# EAGLE design h-bridge-mk1 (EAGLE 6.3)
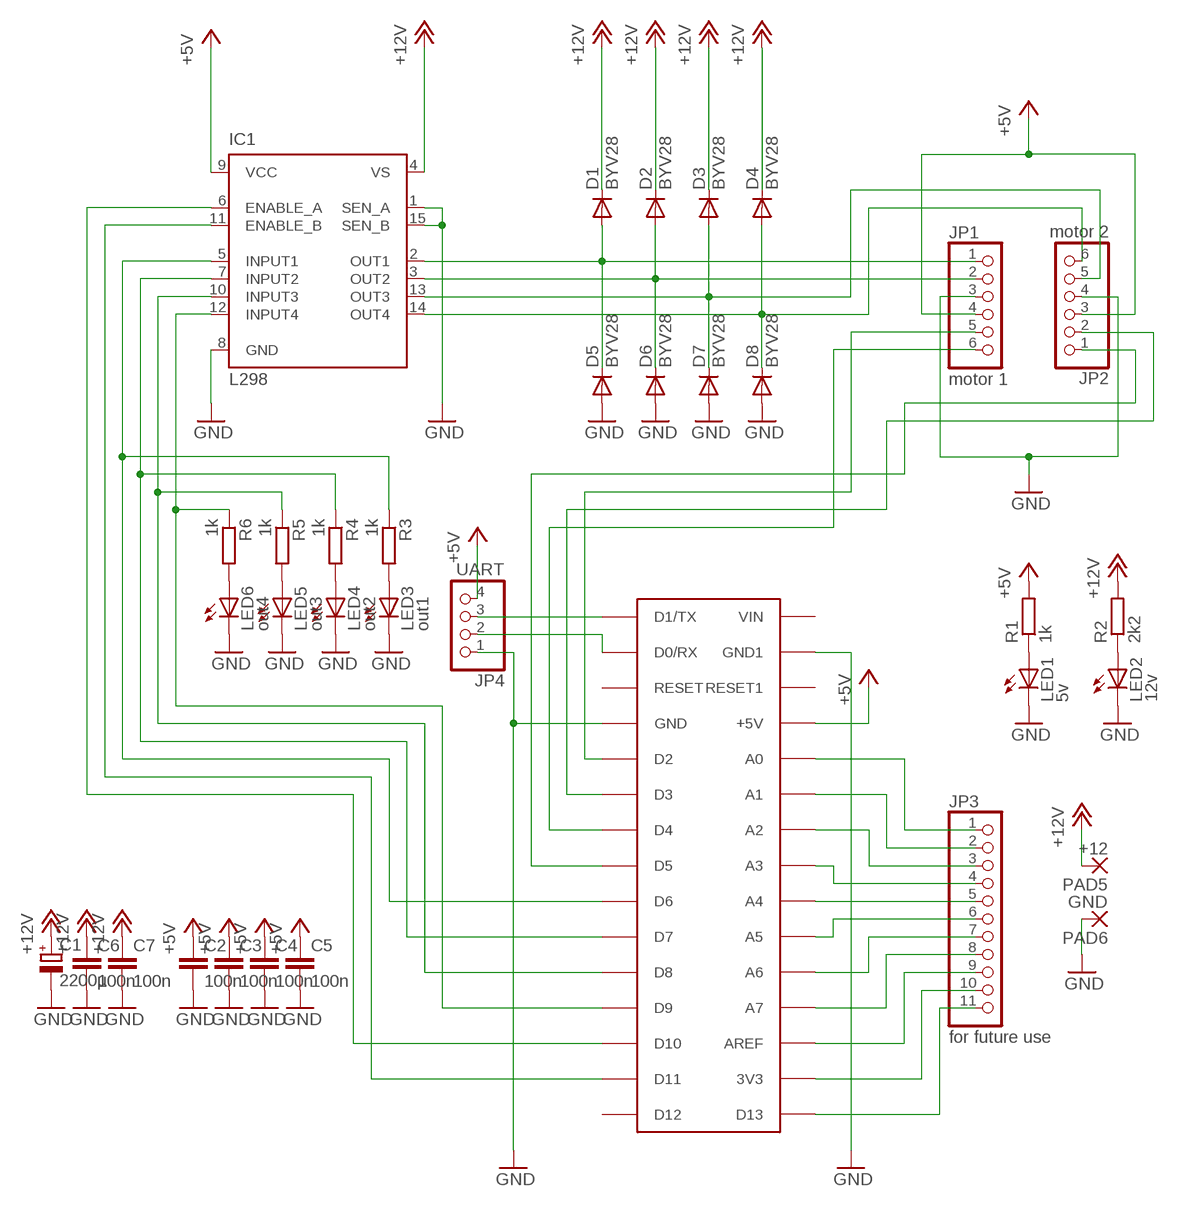
[diagram p0: schematic, sheet 1]

## Parts
C1  2200µ  CPOL-EUE5-10.5  [E5-10,5]
C2  100n  C-EU025-025X050  [C025-025X050]
C3  100n  C-EU025-025X050  [C025-025X050]
C4  100n  C-EU025-025X050  [C025-025X050]
C5  100n  C-EU025-025X050  [C025-025X050]
C6  100n  C-EU025-025X050  [C025-025X050]
C7  100n  C-EU025-025X050  [C025-025X050]
D1  BYV28  [SOD64-10]
D2  BYV28  [SOD64-10]
D3  BYV28  [SOD64-10]
D4  BYV28  [SOD64-10]
D5  BYV28  [SOD64-10]
D6  BYV28  [SOD64-10]
D7  BYV28  [SOD64-10]
D8  BYV28  [SOD64-10]
IC1  L298  [MULTIWATT-15]
JP1  motor 1  PINHD-1X6  [1X06]
JP2  motor 2  PINHD-1X6  [1X06]
JP3  for future use  PINHD-1X11  [1X11]
JP4  UART  PINHD-1X4  [1X04]
LED1  5v  LED3MM  [LED3MM]
LED2  12v  LED3MM  [LED3MM]
LED3  out1  LED3MM  [LED3MM]
LED4  out2  LED3MM  [LED3MM]
LED5  out3  LED3MM  [LED3MM]
LED6  out4  LED3MM  [LED3MM]
PAD5  +12  3,81/1,1  [3,81/1,1]
PAD6  GND  3,81/1,1  [3,81/1,1]
R1  1k  R-EU_0207/10  [0207/10]
R2  2k2  R-EU_0207/10  [0207/10]
R3  1k  R-EU_0207/10  [0207/10]
R4  1k  R-EU_0207/10  [0207/10]
R5  1k  R-EU_0207/10  [0207/10]
R6  1k  R-EU_0207/10  [0207/10]
U$1  ARDUINONANO  [PDIP-32]

## Nets
+5V: C2.1 C3.1 C4.1 C5.1 IC1.9(VCC) JP1.4 JP2.3 JP4.4 R1.2 U$1.+5V
+12V: C1.+ C6.1 C7.1 D1.C D2.C D3.C D4.C IC1.4(VS) PAD5.1(P) R2.2
ENA: IC1.6(ENABLE_A) U$1.D10
ENB: IC1.11(ENABLE_B) U$1.D11
GND: C1.- C2.2 C3.2 C4.2 C5.2 C6.2 C7.2 D5.A D6.A D7.A D8.A IC1.1(SEN_A) IC1.8(GND) IC1.15(SEN_B) JP1.3 JP2.4 JP4.1 LED1.K(C) LED2.K(C) LED3.K(C) LED4.K(C) LED5.K(C) LED6.K(C) PAD6.1(P) U$1.GND U$1.GND1
INA1: IC1.5(INPUT1) R3.1 U$1.D6
INA2: IC1.7(INPUT2) R4.1 U$1.D7
INB1: IC1.10(INPUT3) R5.1 U$1.D8
INB2: IC1.12(INPUT4) R6.1 U$1.D9
N$1: JP3.1 U$1.A0
N$2: JP3.2 U$1.A1
N$3: JP3.3 U$1.A2
N$4: JP3.4 U$1.A3
N$5: JP2.2 U$1.D3
N$6: JP1.6 U$1.D4
N$7: JP2.1 U$1.D5
N$8: JP3.5 U$1.A4
N$9: JP1.5 U$1.D2
N$10: JP3.6 U$1.A5
N$11: JP3.7 U$1.A6
N$12: JP3.8 U$1.A7
N$13: JP3.9 U$1.AREF
N$14: JP3.10 U$1.3V3
N$15: JP3.11 U$1.D13
N$16: LED1.A R1.1
N$17: LED2.A R2.1
N$18: LED3.A R3.2
N$19: LED4.A R4.2
N$20: LED5.A R5.2
N$21: LED6.A R6.2
N$25: JP4.3 U$1.D1/TX
N$26: JP4.2 U$1.D0/RX
OUT1: D1.A D5.C IC1.2(OUT1) JP1.1
OUT2: D2.A D6.C IC1.3(OUT2) JP1.2
OUT3: D3.A D7.C IC1.13(OUT3) JP2.5
OUT4: D4.A D8.C IC1.14(OUT4) JP2.6
Unconnected: U$1.D12 U$1.RESET U$1.RESET1 U$1.VIN

## Library data of the parts
C1 = rcl:CPOL-EU: POLARIZED CAPACITOR, European symbol
C2-C7 = rcl:C-EU: CAPACITOR, European symbol
D1-D8 = diode:BYV28: DIODE ultra fast
IC1 = st-microelectronics:L298: DUAL FULL-BRIDGE DRIVER; MPN: L298N; OC_FARNELL: 1589425; OC_NEWARK: 32M1527
JP1 JP2 = pinhead:PINHD-1X6: PIN HEADER
JP3 = pinhead:PINHD-1X11: PIN HEADER
JP4 = pinhead:PINHD-1X4: PIN HEADER
LED1-LED6 = led:LED: LED OSRAM: - CHIPLED LG R971, LG N971, LY N971, LG Q971, LY Q971, LO R971, LY R971 LH N974, LH R974 LS Q976, LO Q976, LY Q976 LO Q996 - Hyper CHIPLED LW Q18S LB Q993, LB Q99A, LB R99A - SideLED LS A670, LO A670, LY A670, LG A670, LP A670 LB A673, LV A673, LT A673, LW A673 LH A674 LY A675 LS A676, LA A676, LO A676, LY A676, LW A676 LS A679, LY A679, LG A679 - Hyper Micro SIDELED® LS Y876, LA Y876, LO Y876, LY Y876 LT Y87S - SmartLED LW L88C, LW L88S LB L89C, LB L89S, LG L890 LS L89K, LO L89K, LY L89K LS L896, LA L896, LO L896, LY L896 - TOPLED LS T670, LO T670, LY T670, LG T670, LP T670 LSG T670, LSP T670, LSY T670, LOP T670, LYG T670 LG T671, LOG T671, LSG T671 LB T673, LV T673, LT T673, LW T673 LH T674 LS T676, LA T676, LO T676, LY T676, LB T676, LH T676, LSB T676, LW T676 LB T67C, LV T67C, LT T67C, LS T67K, LO T67K, LY T67K, LW E67C LS E67B, LA E67B, LO E67B, LY E67B, LB E67C, LV E67C, LT E67C LW T67C LS T679, LY T679, LG T679 LS T770, LO T770, LY T770, LG T770, LP T770 LB T773, LV T773, LT T773, LW T773 LH T774 LS E675, LA E675, LY E675, LS T675 LS T776, LA T776, LO T776, LY T776, LB T776 LHGB T686 LT T68C, LB T68C - Hyper Mini TOPLED® LB M676 - Mini TOPLED Santana® LG M470 LS M47K, LO M47K, LY M47K Source: http://www.osram.convergy.de LUXEON: - LUMILED® LXK2-PW12-R00, LXK2-PW12-S00, LXK2-PW14-U00, LXK2-PW14-V00 LXK2-PM12-R00, LXK2-PM12-S00, LXK2-PM14-U00 LXK2-PE12-Q00, LXK2-PE12-R00, LXK2-PE12-S00, LXK2-PE14-T00, LXK2-PE14-U00 LXK2-PB12-K00, LXK2-PB12-L00, LXK2-PB12-M00, LXK2-PB14-N00, LXK2-PB14-P00, LXK2-PB14-Q00 LXK2-PR12-L00, LXK2-PR12-M00, LXK2-PR14-Q00, LXK2-PR14-R00 LXK2-PD12-Q00, LXK2-PD12-R00, LXK2-PD12-S00 LXK2-PH12-R00, LXK2-PH12-S00 LXK2-PL12-P00, LXK2-PL12-Q00, LXK2-PL12-R00 Source: www.luxeon.com KINGBRIGHT: KA-3528ASYC Source: www.kingbright.com
PAD5 PAD6 = wirepad:3,81/1,1: THROUGH-HOLE PAD
R1-R6 = rcl:R-EU_: RESISTOR, European symbol
U$1 = jet-lib:ARDUINONANO

## Board
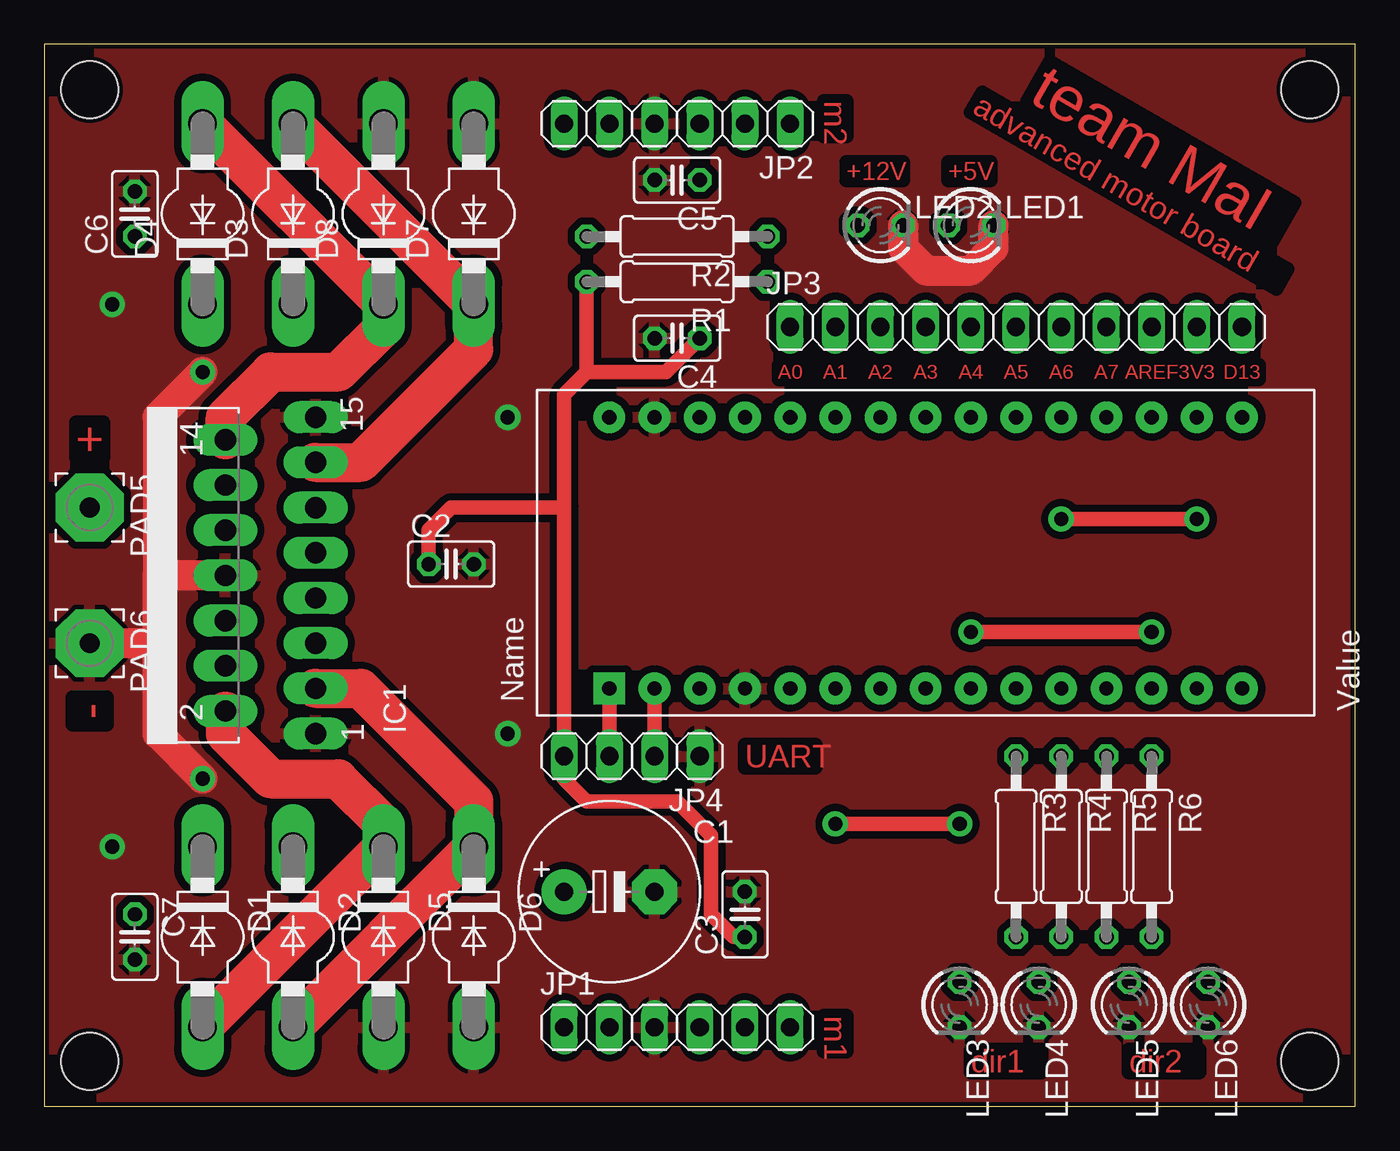
[diagram p1: board, top side]
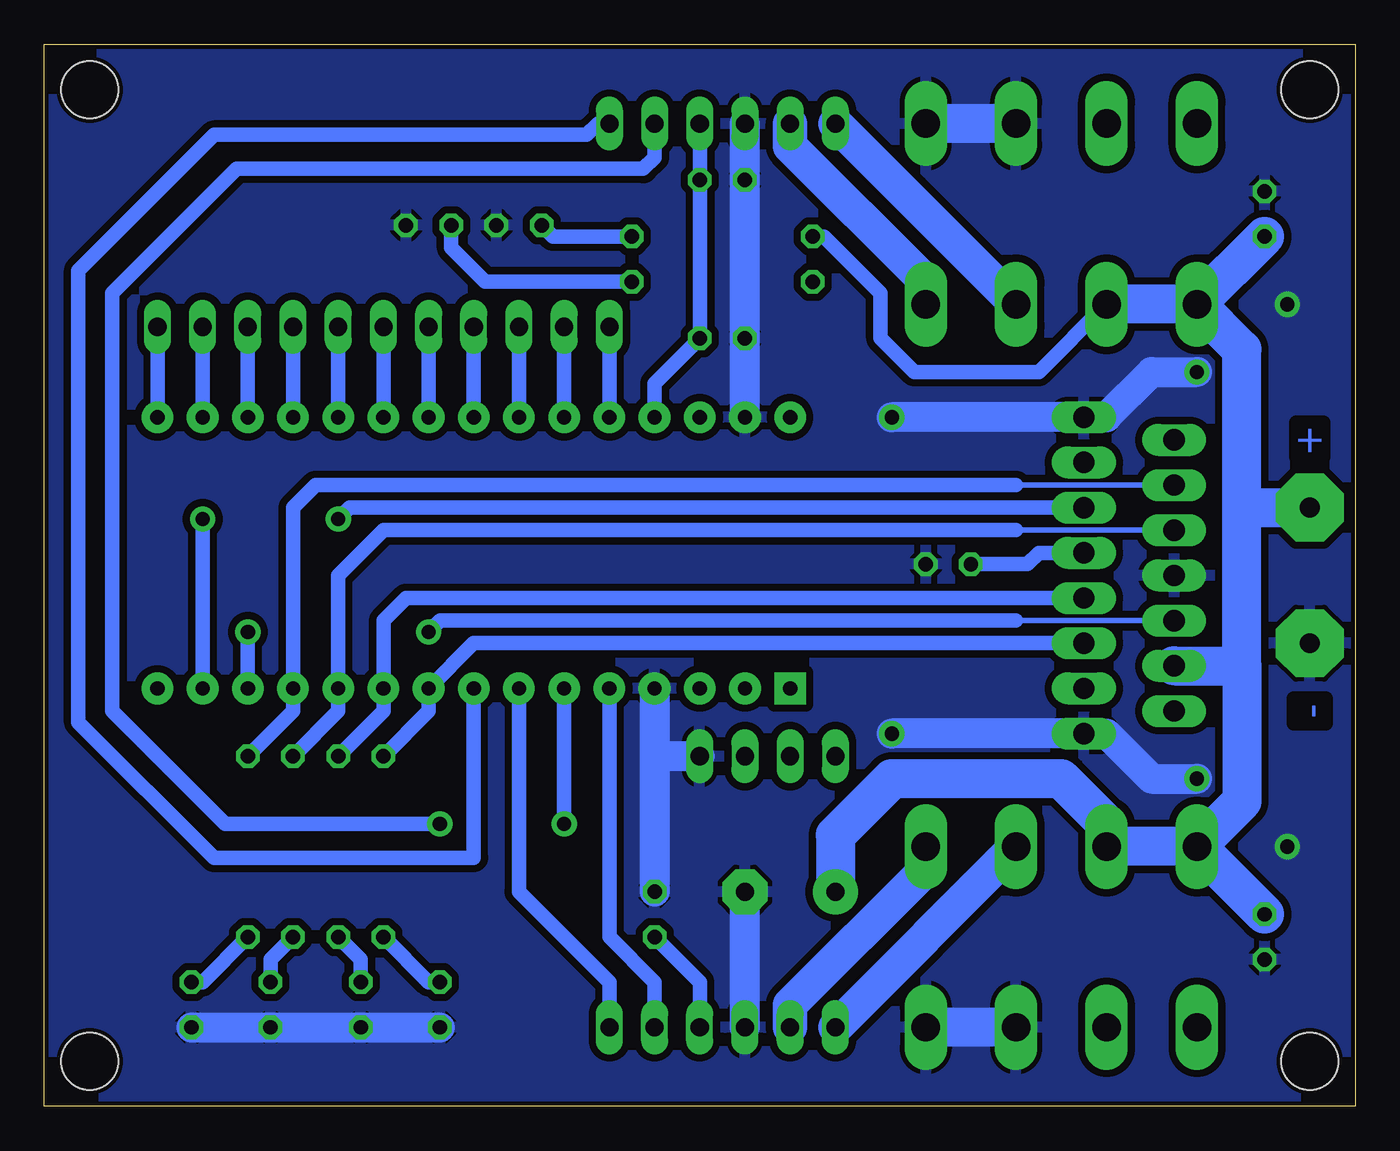
[diagram p2: board, bottom side, seen from below]

Size 73.66 x 59.69 mm. Coordinates in mm from the lower left corner, seen from the top.
Outline: 0,0 73.66,0 73.66,59.69 0,59.69 0,0
Copper layers (1*16): Top 0.035mm / dielectric 1.5mm / Bottom 0.035mm
Design rules "default *": minimum track width 10mil, minimum drill 24mil, track to track 16mil, track to pad 16mil, pad to pad 16mil, via to via 16mil, smd to smd 8mil, copper to edge 10mil, drill to drill 8mil, minimum pad ring 10mil, minimum via ring 8mil, stop-mask expansion 4mil, vias tented up to drill 0mil, thermal gap 10mil
Holes 3.2 mm at 2.54,2.54 71.12,57.15 2.54,57.15 71.12,2.54

### Footprints (pad centres in the part's own frame; a part is rotated, then mirrored left to right if it is on the bottom)
E5-10,5 = drill 1.016 pad 2.54: + -2.54,0 | drill 1.016 pad 2.54 octagon: - 2.54,0
C025-025X050 = drill 0.813 octagon: 1 -1.27,0; 2 1.27,0
SOD64-10 = drill 1.6 long: A 5.08,0; C -5.08,0
MULTIWATT-15 = drill 1.2 long: 1 -8.89,-7.62; 2 -7.62,-2.54; 3 -6.35,-7.62; 4 -5.08,-2.54; 5 -3.81,-7.62; 6 -2.54,-2.54; 7 -1.27,-7.62; 8 0,-2.54; 9 1.27,-7.62; 10 2.54,-2.54; 11 3.81,-7.62; 12 5.08,-2.54; 13 6.35,-7.62; 14 7.62,-2.54; 15 8.89,-7.62
1X06 = drill 1.016 long: 1 -6.35,0; 2 -3.81,0; 3 -1.27,0; 4 1.27,0; 5 3.81,0; 6 6.35,0
1X11 = drill 1.016 long: 1 -12.7,0; 2 -10.16,0; 3 -7.62,0; 4 -5.08,0; 5 -2.54,0; 6 0,0; 7 2.54,0; 8 5.08,0; 9 7.62,0; 10 10.16,0; 11 12.7,0
1X04 = drill 1.016 long: 1 -3.81,0; 2 -1.27,0; 3 1.27,0; 4 3.81,0
LED3MM = drill 0.813 octagon: A -1.27,0; K 1.27,0
3,81/1,1 = drill 1.118 pad 3.81 octagon: 1 0,0
0207/10 = drill 0.813 octagon: 1 -5.08,0; 2 5.08,0
PDIP-32 = drill 0.8 pad 1.778: 3V3 15.24,-35.56; +5V 15.24,-10.16; A0 15.24,-12.7; A1 15.24,-15.24; A2 15.24,-17.78; A3 15.24,-20.32; A4 15.24,-22.86; A5 15.24,-25.4; A6 15.24,-27.94; A7 15.24,-30.48; AREF 15.24,-33.02; D0/RX 0,-5.08; D2 0,-12.7; D3 0,-15.24; D4 0,-17.78; D5 0,-20.32; D6 0,-22.86; D7 0,-25.4; D8 0,-27.94; D9 0,-30.48; D10 0,-33.02; D11 0,-35.56; D12 0,-38.1; D13 15.24,-38.1; GND 0,-10.16; GND1 15.24,-5.08; RESET 0,-7.62; RESET1 15.24,-7.62; VIN 15.24,-2.54 | drill 0.8 pad 1.778 square: D1/TX 0,-2.54

### Placement (x,y rotation side)
C1  31.75,12.06 0 top
C2  22.86,30.48 0 top
C3  39.37,10.79 90 top
C4  35.56,43.18 180 top
C5  35.56,52.07 180 top
C6  5.08,50.16 90 top
C7  5.08,9.53 270 top
D1  8.89,9.53 270 top
D2  13.97,9.53 270 top
D3  13.97,50.16 90 top
D4  8.89,50.16 90 top
D5  19.05,9.53 270 top
D6  24.13,9.53 270 top
D7  24.13,50.16 90 top
D8  19.05,50.16 90 top
IC1  7.62,29.84 90 top
JP1  35.56,4.45 0 top
JP2  35.56,55.24 180 top
JP3  54.61,43.81 0 top
JP4  33.02,19.68 180 top
LED1  52.07,49.53 0 top
LED2  46.99,49.53 0 top
LED3  51.44,5.71 270 top
LED4  55.88,5.71 270 top
LED5  60.96,5.71 270 top
LED6  65.41,5.71 270 top
PAD5  2.54,33.66 270 top
PAD6  2.54,26.04 270 top
R1  35.56,46.35 180 top
R2  35.56,48.9 180 top
R3  54.61,14.61 270 top
R4  57.15,14.61 270 top
R5  59.69,14.61 270 top
R6  62.23,14.61 270 top
U$1  29.21,23.5 90 top

### Tracks (layer width: path | path; a pad name or v marks a point on that pad's centre or on a via)
+5V
  Top 0.813: 30.48,41.27 29.21,40.01 29.21,33.66 | C2.1 21.59,32.38 22.86,33.66 29.21,33.66 | R1.2 30.48,41.27 | 30.48,41.27 34.92,41.27 C4.1 | 29.21,33.66 JP4.4 29.21,18.41 30.48,17.14 35.56,17.14 37.47,15.24 37.47,10.79 38.73,9.53 C3.1
  Bottom 0.813: C2.1 18.41,30.48 17.78,31.11 IC1.9 | JP2.3 C5.1 C4.1 39.37,40.64 U$1.+5V | JP1.4 36.83,6.99 C3.1
+12V
  Bottom 0.813: D3.C 17.78,41.27 24.77,41.27 26.67,43.18 26.67,45.72 29.84,48.9 R2.2
  Bottom 1.676: D2.C 13.97,15.88
  Bottom 2.184: 13.97,15.88 16.51,18.41 26.04,18.41 29.21,15.24 C1.+ | C6.1 D4.C | C7.1 D1.C | 6.35,24.77 6.35,33.66 | 6.35,33.66 PAD5.1 | IC1.4 6.35,24.77 | 6.35,24.77 6.35,17.14 D1.C | 6.35,33.66 6.35,42.55 D4.C | D4.C D3.C | D1.C D2.C
ENA  (via drill 0.8 pad 1.42)
  Top 0.813: v62.23,26.67 v52.07,26.67
  Bottom 0.305: 19.05,27.3 IC1.6
  Bottom 0.813: U$1.D10 v62.23,26.67 | 19.05,27.3 51.44,27.3 v52.07,26.67
ENB  (via drill 0.8 pad 1.42)
  Top 0.813: v57.15,33.02 v64.77,33.02
  Bottom 0.813: U$1.D11 v64.77,33.02 | IC1.11 56.52,33.66 v57.15,33.02
GND  (via drill 0.8 pad 1.42)
  Top 1.676: IC1.8 6.35,29.84 | v8.89,41.27 6.35,38.73 6.35,29.84 | v8.89,18.41 6.35,20.95 6.35,26.04 | 6.35,26.04 6.35,29.84 | PAD6.1 6.35,26.04 | LED2.K 48.26,48.26 49.53,46.99 52.07,46.99 53.34,48.26 LED1.K
  Bottom 1.676: v8.89,18.41 11.43,18.41 13.97,20.95 IC1.1 v26.04,20.95 | v8.89,41.27 11.43,41.27 13.97,38.73 IC1.15 v26.04,38.73 | C5.2 JP2.4 C4.2 U$1.GND1 | U$1.GND 39.37,19.68 | JP4.1 39.37,19.68 | LED6.K LED5.K LED4.K LED3.K | 39.37,19.68 C3.2 | JP1.3 C1.-
  Bottom 2.184: D5.A D6.A | D8.A D7.A
  other vias: 3.81,45.09 3.81,14.61
  pour Bottom: 0,59.69 73.66,59.69 73.66,0 0,0
  pour Top: 0,59.69 73.66,59.69 73.66,0 0,0
INA1
  Bottom 0.813: IC1.5 49.53,26.04 U$1.D6 52.07,22.23 R3.1
INA2
  Bottom 0.813: IC1.7 53.34,28.57 54.61,27.3 U$1.D7 54.61,22.23 R4.1
INB1
  Bottom 0.305: IC1.10 19.05,32.38
  Bottom 0.813: 19.05,32.38 54.61,32.38 57.15,29.84 U$1.D8 57.15,22.23 R5.1
INB2
  Bottom 0.305: IC1.12 19.05,34.92
  Bottom 0.813: 19.05,34.92 58.42,34.92 59.69,33.66 U$1.D9 59.69,22.23 R6.1
N$1
  Bottom 0.813: U$1.A0 JP3.1
N$2
  Bottom 0.813: JP3.2 U$1.A1
N$3
  Bottom 0.813: JP3.3 U$1.A2
N$4
  Bottom 0.813: U$1.A3 JP3.4
N$5  (via drill 0.8 pad 1.42)
  Top 0.813: v44.45,15.88 v51.44,15.88
  Bottom 0.813: v51.44,15.88 63.5,15.88 69.85,22.23 69.85,45.72 62.87,52.7 40.01,52.7 39.37,53.34 JP2.2 | v44.45,15.88 U$1.D3
N$6
  Bottom 0.813: U$1.D4 46.99,12.06 41.91,6.99 JP1.6
N$7
  Bottom 0.813: U$1.D5 49.53,13.97 64.14,13.97 71.75,21.59 71.75,46.99 64.14,54.61 43.18,54.61 42.55,55.24 JP2.1
N$8
  Bottom 0.813: JP3.5 U$1.A4
N$9
  Bottom 0.813: JP1.5 39.37,6.99 41.91,9.53 U$1.D2
N$10
  Bottom 0.813: U$1.A5 JP3.6
N$11
  Bottom 0.813: JP3.7 U$1.A6
N$12
  Bottom 0.813: JP3.8 U$1.A7
N$13
  Bottom 0.813: U$1.AREF JP3.9
N$14
  Bottom 0.813: JP3.10 U$1.3V3
N$15
  Bottom 0.813: JP3.11 U$1.D13
N$16
  Bottom 0.813: R1.1 48.9,46.35 50.8,48.26 LED1.A
N$17
  Bottom 0.813: R2.1 45.09,48.9 LED2.A
N$18
  Bottom 0.813: LED3.A 52.07,6.99 R3.2
N$19
  Bottom 0.813: LED4.A 55.88,8.26 R4.2
N$20
  Bottom 0.813: LED5.A 60.96,8.26 R5.2
N$21
  Bottom 0.813: LED6.A 64.77,6.99 R6.2
N$25
  Top 0.813: U$1.D1/TX JP4.3
N$26
  Top 0.813: JP4.2 U$1.D0/RX
OUT1
  Top 2.184: IC1.2 10.16,20.95 12.7,18.41 16.51,18.41 19.05,15.88 D5.C D1.A
  Bottom 1.93: JP1.1 D5.C
OUT2
  Top 2.184: IC1.3 17.78,23.5 24.13,17.14 D6.C D2.A
  Bottom 1.93: 24.13,13.34 31.75,5.71 JP1.2
  Bottom 2.184: D6.C 24.13,13.34
OUT3
  Top 2.184: IC1.13 17.78,36.2 24.13,42.55 D7.C D3.A
  Bottom 1.93: D7.C 24.13,46.35 31.75,53.98 JP2.5
OUT4
  Top 2.184: IC1.14 10.16,38.73 12.7,41.27 16.51,41.27 19.05,43.81 D8.C D4.A
  Bottom 1.93: D8.C JP2.6

### Text on the board
Top: m2 | team MaI | advanced motor board | +12V | +5V | A0 | A1 | A2 | A3 | A4 | A5 | A6 | A7 | AREF | 3V3 | D13 | + | - | UART | m1 | dir1 | dir2
Bottom: + | -